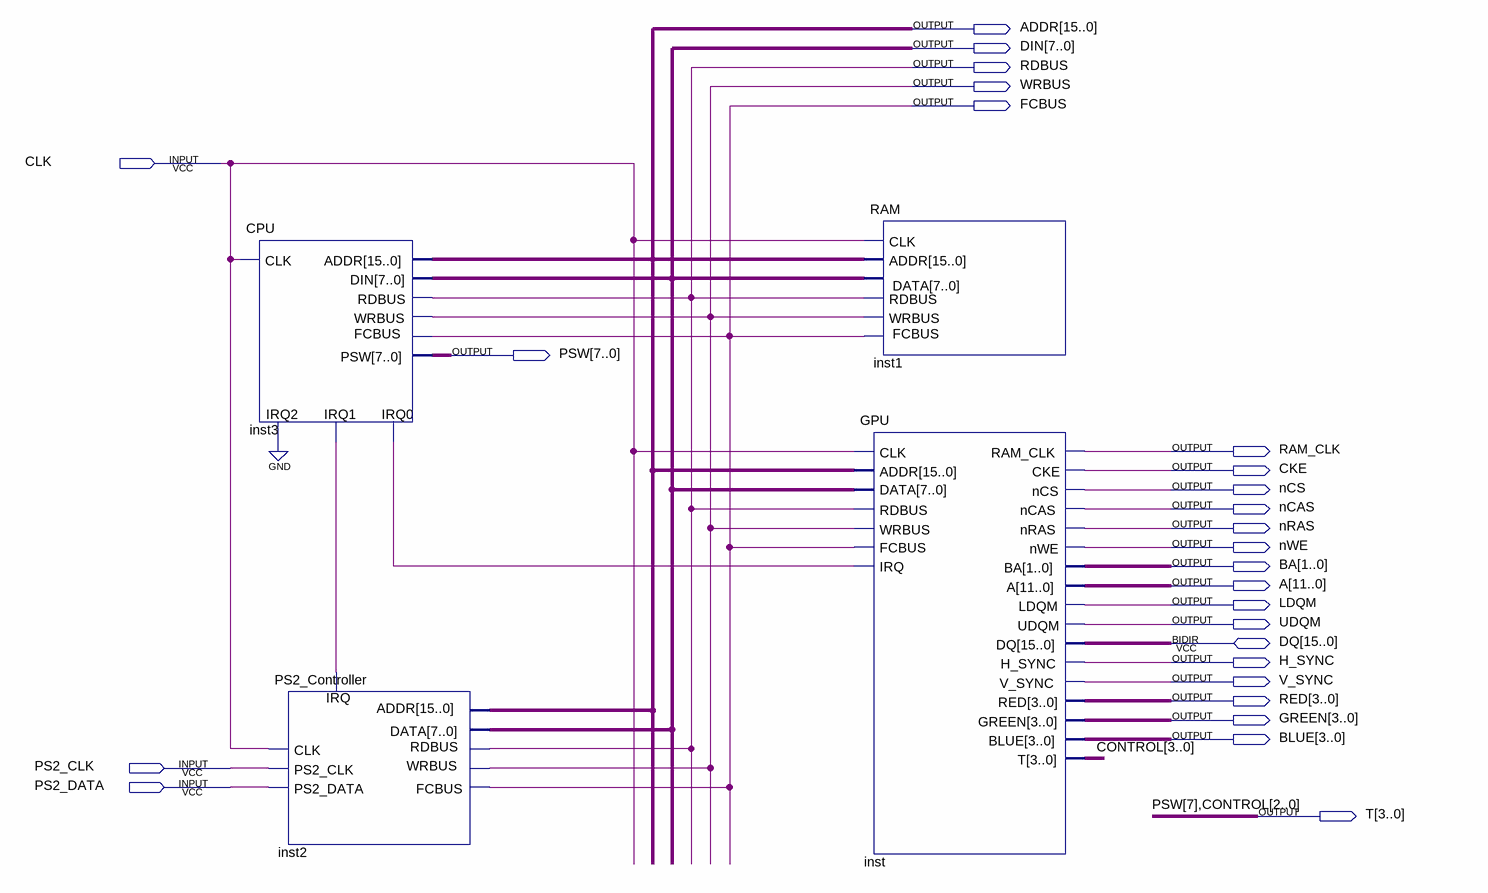
[diagram p0: schematic sheet]
// Quartus schematic main.bdf as structural Verilog: 4 symbols, 26 pins
module main (
  input  CLK,
  input  PS2_CLK,
  input  PS2_DATA,
  inout  [15:0] DQ,
  output [15:0] ADDR,
  output [7:0] DIN,
  output RDBUS,
  output WRBUS,
  output FCBUS,
  output [7:0] PSW,
  output RAM_CLK,
  output CKE,
  output nCS,
  output nCAS,
  output nRAS,
  output nWE,
  output [1:0] BA,
  output [11:0] A,
  output LDQM,
  output UDQM,
  output H_SYNC,
  output V_SYNC,
  output [3:0] RED,
  output [3:0] GREEN,
  output [3:0] BLUE,
  output [3:0] T
);

  wire inst2_irq, inst_irq;
  wire [3:3] CONTROL;

  CPU inst3 (
    .CLK(CLK), .FCBUS(FCBUS), .IRQ0(inst_irq), .IRQ1(inst2_irq), .IRQ2(1'b0), .ADDR(ADDR), .RDBUS(RDBUS),
    .WRBUS(WRBUS), .PSW(PSW), .DIN(DIN));
  PS2_Controller inst2 (
    .CLK(CLK), .PS2_CLK(PS2_CLK), .PS2_DATA(PS2_DATA), .ADDR(ADDR), .RDBUS(RDBUS), .WRBUS(WRBUS),
    .FCBUS(FCBUS), .IRQ(inst2_irq), .DATA(DIN));
  RAM inst1 (.CLK(CLK), .ADDR(ADDR), .RDBUS(RDBUS), .WRBUS(WRBUS), .DATA(DIN), .FCBUS(FCBUS));
  GPU inst (
    .CLK(CLK), .ADDR(ADDR), .RDBUS(RDBUS), .WRBUS(WRBUS), .RAM_CLK(RAM_CLK), .CKE(CKE), .nCS(nCS),
    .nCAS(nCAS), .nRAS(nRAS), .nWE(nWE), .BA(BA), .A(A), .LDQM(LDQM), .UDQM(UDQM), .H_SYNC(H_SYNC),
    .V_SYNC(V_SYNC), .RED(RED), .GREEN(GREEN), .BLUE(BLUE), .FCBUS(FCBUS), .IRQ(inst_irq),
    .T({CONTROL[3], T[2:0]}), .DQ(DQ), .DATA(DIN));

  assign T[3] = PSW[7];

  // Other names for the same wires on the sheet: CONTROL[2:0] = T[2:0]
endmodule
